# Altium schematic sheet linearInjector_main.SchDoc
size A4
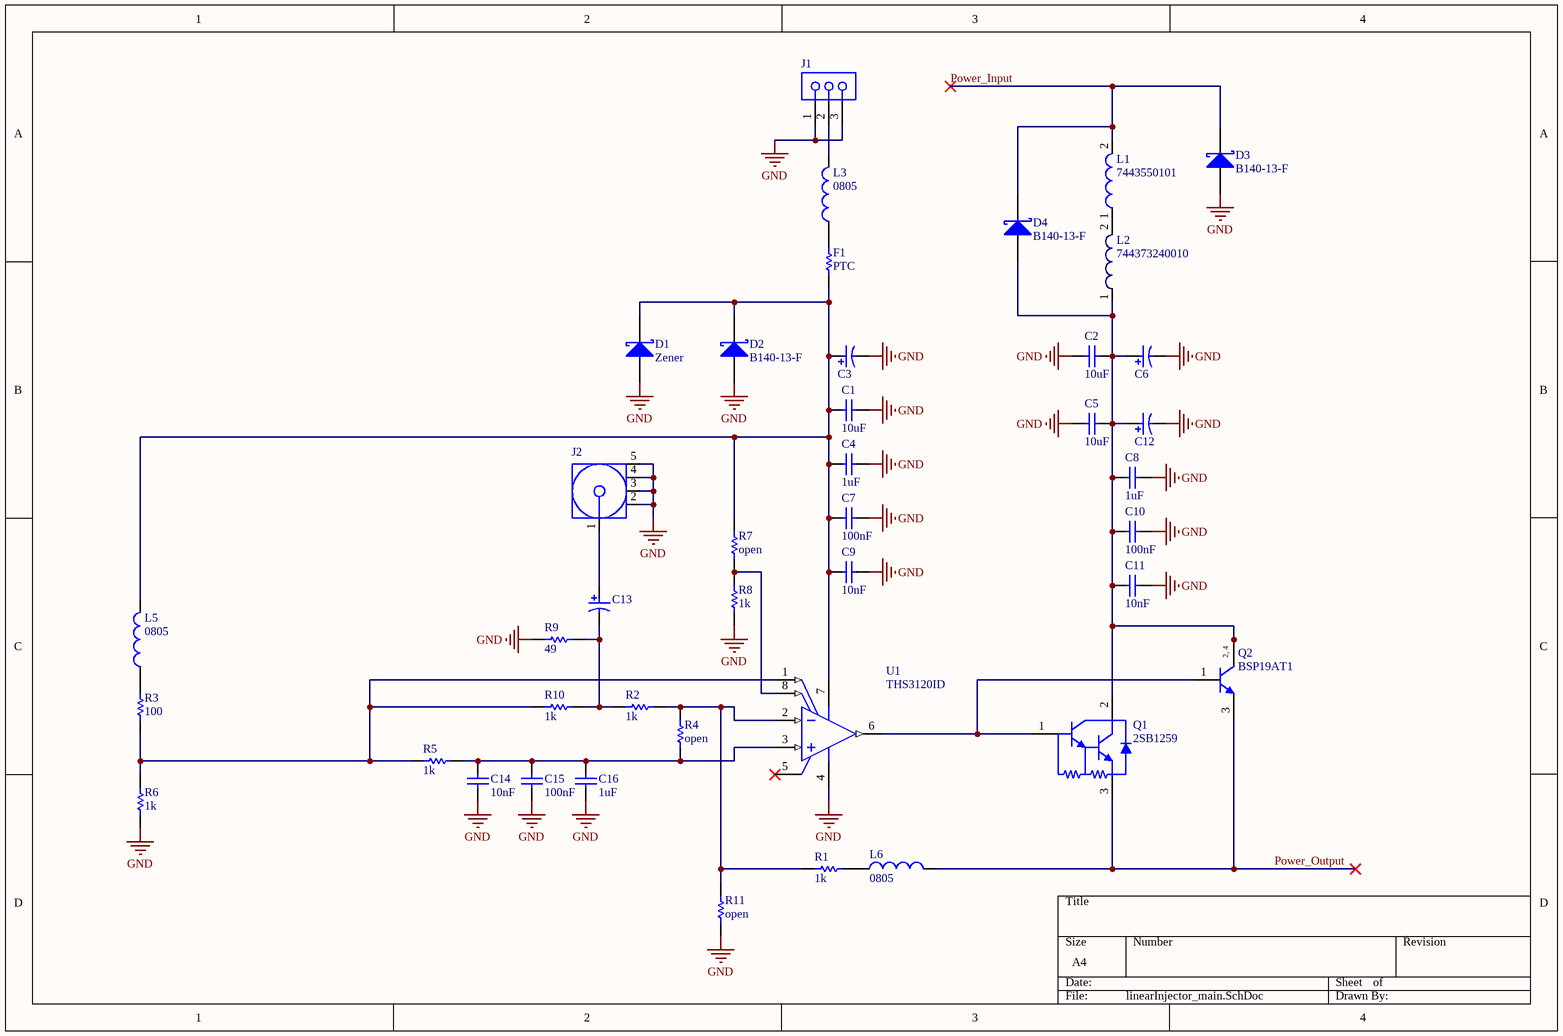
[diagram p0: linearInjector_main.SchDoc]

## Parts
C1  10uF  [CAPC1206(3216)130_M]
C2  10uF  [CAPC1206(3216)130_L]
C3  alum  [PNSC-NF-A_V]  (value not drawn)
C4  1uF  [CAPC0805(2012)75_M]
C5  10uF  [CAPC1206(3216)130_L]
C6  alum  [PNSC-NF-A_V]  (value not drawn)
C7  100nF  [CAPC0805(2012)75_M]
C8  1uF  [CAPC0805(2012)75_M]
C9  10nF  [CAPC0805(2012)75_M]
C10  100nF  [CAPC0805(2012)75_M]
C11  10nF  [CAPC0805(2012)75_M]
C12  alum  [PNSC-NF-A_V]  (value not drawn)
C13  alum  [PNSC-NF-A_V]  (value not drawn)
C14  10nF  [CAPC0805(2012)75_M]
C15  100nF  [CAPC0805(2012)75_M]
C16  1uF  [CAPC0805(2012)75_M]
D1  Zener  [DIOD-B1X0-2_V]
D2  B140-13-F  [DIOD-B1X0-2_V]
D3  B140-13-F  [DIOD-B1X0-2_V]
D4  B140-13-F  [DIOD-B1X0-2_V]
F1  PTC  [RESC1206(3216)_M]
J1  BCS-103-L-S-TE  [SMTC-BCS-103-X-S-TE]  (value not drawn)
J2  LTI-SASF54GT  [LHT-LTI-SASF54GT_V]  (value not drawn)
L1  7443550101  [WE-HCI-1350]
L2  744373240010  [WE-LHMI 4020]
L3  0805  [INDC2013X105X50ML20T30]
L5  0805  [INDC2013X105X50ML20T30]
L6  0805  [INDC2013X105X50ML20T30]
Q1  2SB1259  [ONSC-TO-220-3-221A-09]
Q2  BSP19AT1  [ONSC-SOT-223-4-318E-04_V]
R1  1k  [RESC0805(2012)_M]
R2  1k  [RESC0805(2012)_M]
R3  100  [RESC0805(2012)_M]
R4  open  [RESC0805(2012)_M]
R5  1k  [RESC0805(2012)_M]
R6  1k  [RESC0805(2012)_M]
R7  open  [RESC0805(2012)_M]
R8  1k  [RESC0805(2012)_M]
R9  49  [RESC0805(2012)_M]
R10  1k  [RESC0805(2012)_M]
R11  open  [RESC0805(2012)_M]
U1  THS3120ID  [D0008A_L]

## Nets
GND: C1.2 C2.2 C3.2 C4.1 C5.2 C6.2 C7.1 C8.1 C9.1 C10.1 C11.1 C12.2 C14.1 C15.1 C16.1 D1.2(A) D2.2(A) D3.2(A) J1.1 J1.3 J2.2 J2.3 J2.4 J2.5 R6.1 R8.1 R9.1 R11.1 U1.4(VS-)
Power_Input: D3.1(K) D4.1(K) L1.2
Power_Output: L6.2 Q1.3(E) Q2.3(E)
NetC1_1: C1.1 C3.1 C4.2 C7.2 C9.2 D1.1(K) D2.1(K) F1.1 L5.2 R7.2 U1.7(VS+)
NetC2_1: C2.1 C5.1 C6.1 C8.2 C10.2 C11.2 C12.1 D4.2(A) L2.1 Q1.2(C) Q2.2(C) Q2.4(C)
NetC13_1: C13.1 J2.1
NetC13_2: C13.2 R2.1 R9.2 R10.2
NetC14_2: C14.2 C15.2 C16.2 R4.1 R5.2 U1.3(VIN+)
NetF1_2: F1.2 L3.1
NetJ1_2: J1.2 L3.2
NetL1_1: L1.1 L2.2
NetL5_1: L5.1 R3.2
NetL6_1: L6.1 R1.2
NetQ1_1: Q1.1(B) Q2.1(B) U1.6(VOUT)
NetR1_1: R1.1 R2.2 R4.2 R11.2 U1.2(VIN-)
NetR3_1: R3.1 R5.1 R6.2 R10.1 U1.1(REF)
NetR7_1: R7.1 R8.2 U1.8(PD)

Not connected (* = marked no-connect by the designer): U1 5(NC)*

## Notes on the sheet
- (in symbol CMP-1048-00457-1) 2, 4

## Library data of the parts
C1 C2 C5 = CMP-1037-04970-1: Case-Metric: 3216; Rated Voltage: 10 V; Tolerance: -20% to +80%; Case-EIA: 1206; Value: 10uF; Technology: SMT; Max Thickness: 1.3 mm
C3 C6 C12 C13 = CMP-2000-06196-1: 5mm lead pitch; Manufacturer: Panasonic; Voltage: 5.5Vdc; Lifetime: 1000h; Lead Diameter: 0.8mm; Tolerance Plus: +80%; Tolerance: -20→+80%; Tolerance Minus: -20%; Capacitance: 0.22F; Height: 7.5mm; Manufacturer URL: http://www.panasonic.com/; Depth: 7.5mm; Terminal Type: ThroughHole; Mounting Technology: ThroughHole; Package Reference: NF-A; Maximum Operating Temperature: +70°C; Datasheet URL: https://industrial.panasonic.com/cdbs/www-data/pdf/RDG0000/ABC0000C90.pdf; Dimensions: 13.5(Dia.)x7.5mm; Package Description: 2-Pin Through Hole Device, Dia 13.5 mm; Lead Pitch: 5mm; Datasheet Version: 08/2016; Mounting Type: ThroughHole; Minimum Operating Temperature: -25°C; Diameter: 13.5mm; Series: NF
C4 C7 C8 C10 C15 C16 = CMP-1036-03812-1: Case-EIA: 0805; Value: 10nF; Rated Voltage: 10 V; Tolerance: -20% to +80%; Case-Metric: 2012; Technology: SMT; Max Thickness: 0.75 mm
C9 C11 C14 = CMP-1036-03812-1: Case-EIA: 0805; Rated Voltage: 10 V; Tolerance: -20% to +80%; Case-Metric: 2012; Technology: SMT; Max Thickness: 0.75 mm; Value: 10nF
D1 = CMP-2000-05096-1: option; Manufacturer: DiodesIncorporated; Vrrm - Repetitive Reverse Voltage: 40V; Unit Weight: 0.002258oz; Ir - Reverse Current: 500uA; If - Forward Current: 1A; Ifsm - Forward Surge Current: 30A; Configuration: Single; Vf - Forward Voltage: 0.5V; Type: SchottkyBarrierRectifier; Technology: Si; Mounting Style: SMD/SMT; Package Description: 2-Pin Surface Mount Device, Body 4.3 x 2.605 mm; Datasheet Version: Rev. 18-2, 05/2013; Product: SchottkyDiodes; Height: 2.1mm; RoHS: True; Maximum Operating Temperature: +150C; Manufacturer URL: http://www.diodes.com/; Datasheet URL: http://www.diodes.com/_files/datasheets/ds13002.pdf; Minimum Operating Temperature: -65C; Package / Case: SMA; Termination Style: SMD/SMT; Length: 4.6mm; Operating Temperature Range: -65Cto+150C; Package Reference: SMA; Product Category: SchottkyDiodes&Rectifiers; Factory Pack Quantity: 5000; Series: B140; Width: 2.92mm; Brand: DiodesIncorporated; Packaging: Reel
D2-D4 = CMP-2000-05096-1: Surface Mount Schottky Barrier Rectifier, 1 A, -65 to 150 degC, 2-Pin SMA, RoHS, Tape and Reel; Manufacturer: DiodesIncorporated; Vrrm - Repetitive Reverse Voltage: 40V; Unit Weight: 0.002258oz; Ir - Reverse Current: 500uA; If - Forward Current: 1A; Ifsm - Forward Surge Current: 30A; Configuration: Single; Vf - Forward Voltage: 0.5V; Technology: Si; Mounting Style: SMD/SMT; Package Description: 2-Pin Surface Mount Device, Body 4.3 x 2.605 mm; Datasheet Version: Rev. 18-2, 05/2013; Product: SchottkyDiodes; Height: 2.1mm; RoHS: True; Maximum Operating Temperature: +150C; Manufacturer URL: http://www.diodes.com/; Datasheet URL: http://www.diodes.com/_files/datasheets/ds13002.pdf; Minimum Operating Temperature: -65C; Package / Case: SMA; Termination Style: SMD/SMT; Length: 4.6mm; Operating Temperature Range: -65Cto+150C; Package Reference: SMA; Product Category: SchottkyDiodes&Rectifiers; Factory Pack Quantity: 5000; Series: B140; Width: 2.92mm; Brand: DiodesIncorporated; Type: SchottkyBarrierRectifier; Packaging: Reel
F1 = CMP-1014-00815-1: Fuse; Case-Metric: 3216; Case-EIA: 1206; Tolerance: 1 %; Power: 0.25 W; Value: 499000.00 Ohm; Technology: SMT
J1 = CMP-1023-00005-1: Tiger Claw(TM) Pass-Through Socket, Vertical, -55 to 125 degC, 2.54 mm Pitch, 3-Pin, Female, RoHS; Manufacturer: Samtec; Pitch: 2.54 mm; ComponentLink2URL: http://www.samtec.com/documents/webfiles/pdf/BCS.PDF; ComponentLink2Description: Datasheet; Orientation: Vertical; ComponentLink1Description: Manufacturer URL; ComponentLink3Description: Package Specification; Temperature Range: -55 to 125 degC; PackageVersion: BV, 9/1991; PartNumber: BCS-103-L-S-TE; PackageReference: BCS-103-X-S-TE; DatasheetVersion: F-214; ComponentLink1URL: http://www.samtec.com; PackageDescription: Box Connector Socket Strip; RoHS: True; Mounting Technology: Through-hole; ComponentLink3URL: http://www.samtec.com/documents/webfiles/cpdf/BCS-1XX-XXX-X-XX-XXX-MKT.pdf
J2 = CMP-1713-00001-1: SMA Connector, Pitch 2.54 mm, 1 Position, Height 9.5 mm, Tail Length 4 mm, RoHS; Manufacturer: Lighthorse Technologies Inc.; ComponentLink2Description: Datasheet; Mounting Technology: Through Hole; ComponentLink1Description: Manufacturer URL; PackageDescription: SMA Connector, Pitch 2.54 mm, 1 Position, Height 9.5 mm, Tail Length 4 mm; PartNumber: LTI-SASF54GT; PackageReference: LTI-SASF54GT; DatasheetVersion: Rev. May-99; ComponentLink2URL: http://rfconnector.com/sheets/SASF54GT.pdf; ComponentLink1URL: http://www.rfconnector.com
L1 = CMP-0226-00031-1: SMD Flat Wire High Current Inductor WE-HCI, L=10.0 µH; Inductance: 10.0 ÂµH; DatasheetVersion: ver 1, Aug-2009; ComponentLink2Description: Datasheet; PackageDescription: Inductor, 2-Leads, Body 13.0 x 12.8 mm; ComponentLink2URL: http://www.we-online.de/katalog/media/pdf/7443550101.pdf; PackageReference: WE-HCI-1350; ComponentLink1URL: http://www.we-online.com; PackageVersion: 2008; ComponentLink1Description: Manufacturer Link
L2 = CMP-1353-00038-1: SMD Power Inductor WE-LHMI, L=0.10 µH; Manufacturer: Wuerth Elektronik; Inductance: 0.10 ÂµH; ComponentLink2URL: http://katalog.we-online.de/kataloge/eisos/media/pdf/744373240010.pdf; ComponentLink2Description: Datasheet; PartNumber: 744373240010; ComponentLink1URL: http://www.we-online.com; ComponentLink1Description: Manufacturer URL; PackageReference: WE-LHMI 4020
L3 L5 L6 = CMP-1660-00003-1: Core Material: Ferrite; Current Rating: 6 A; Tolerance: 30%; Resistance: 4 mohm; Impedance: 21 Ohm; Min Operating Temperature: -40 degC; Width: 1.25 mm; PackageDescription: 2-Pin Surface Mount Device, Body 2 x 1.25 mm; Mounting Technology: Surface Mount; Package Quantity: 1; DatasheetVersion: 08/2016; Mount: Surface Mount; Max Operating Temperature: 125 degC; Height: 0.85 mm; ComponentLink1URL: http://www.t-yuden.com/; Case Code (Metric): 2012; ComponentLink1Description: Manufacturer URL; Case\Package: 0805; ComponentLink2URL: http://ds.yuden.co.jp/TYCOMPAS/ut/detail.do?productNo=FBMJ2125HM210NT&fileName=FBMJ2125HM210NT_SS&mode=specSheetDownload; Case Code (Imperial): 0805; Packaging: Tape and Reel; ComponentLink2Description: Datasheet; PackageReference: 0805; RoHSCompliant: true; Max Current Rating: 6 A; Length: 2 mm; REACH SVHC: Unknown
Q1 = CMP-1031-00034-1: PartNumber: MJE5740G; Manufacturer: On Semiconductor; Packing: Tube; Polarity: NPN; IC Continuous (A): 8; PackageReference: TO-220-3-221A-09; ComponentLink2URL: http://www.onsemi.com/pub_link/Collateral/MJE5740-D.PDF; ComponentLink1URL: http://www.onsemi.com/; Mounting Technology: Through Hole; ComponentLink2Description: Datasheet; ComponentLink1Description: Manufacturer URL; ComponentLink3URL: http://www.onsemi.com/pub_link/Collateral/221A-09.PDF; PackageDescription: 3-Pin Flange Mount, Vertical Straight Lead, Body 9.97 x 4.445 mm, Pitch 2.54 mm; PackageVersion: Rev. AG, 09/2011; DatasheetVersion: Rev. 11; RoHS: TRUE; ComponentLink3Description: Package Specification
Q2 = CMP-1048-00457-1: NPN Silicon Expitaxial Transistor, 4-Pin SOT-223, Tape and Reel; Manufacturer: On Semiconductor; fT Min (MHz): 70; IC Continuous (A): 0.1; PackageDescription: 4-Pin Small Outline Transistor, Body 6.5 x 3.5 mm, Pitch 2.3 mm; ComponentLink3URL: http://www.onsemi.com/pub_link/Collateral/318E-04.PDF; PartNumber: BSP19AT1; Mounting Technology: Surface Mount; Polarity: NPN; DatasheetVersion: Rev. 11; ComponentLink1URL: http://www.onsemi.com/; Packing: Tape and Reel; RoHS: FALSE; ComponentLink2URL: http://www.onsemi.com/pub_link/Collateral/BSP19AT1-D.PDF; ComponentLink3Description: Package Specification; ComponentLink2Description: Datasheet; ComponentLink1Description: Manufacturer URL; PackageReference: SOT-223-4-318E-04; PackageVersion: Rev. N, 08/2009
R1-R3 R5-R11 = CMP-1013-00536-1: 1k 1%; Value: 1780.00 Ohm; Case-EIA: 0805; Case-Metric: 2012; Power: 0.125 W; Tolerance: 1 %; Technology: SMT
R4 = CMP-1013-00536-1: Tolerance: 1 %; Value: 1780.00 Ohm; Case-EIA: 0805; Case-Metric: 2012; Power: 0.125 W; Technology: SMT
U1 = CMP-0018-00123-2: Single, Low Noise, High Output Drive, 475 mA Current-Feedback Amplifier with Power-Down, 10 to 30 V, -40 to 85 degC, 8-pin SOIC (D8), Green (RoHS & no Sb/Br); Manufacturer: Texas Instruments; Diff Gain(%): 0.007; Iib(Max)(nA): 20000; BW @ Acl(MHz): 130; Diff Phase(deg): 0.018; Number of Channels: 1; 3rd Harmonic(dBc): 50; Sub Family: High Output Current Amplifier (>=50mA), High Speed Amplifier (>=50MHz), High Supply Voltage Amplifier (>=30V); Vs(Max)(V): 30; Vs(Min)(V): 10; Settling Time (0.1%)(Typ)(ns): 11; Io(Typ)(mA): 475; Vio(Max)(mV): 8; THD (Fc is 1 MHz)(Typ)(dB): -78; Slew Rate(Typ)(V/us): 1700; Vn at Flatband(Typ)(nV/rtHz): 2.5; 2nd Harmonic(dBc): 51; ComponentLink1Description: Manufacturer URL; PackageDescription: 8-Pin Plastic Small Outline, Body 4.9 x 3.9 mm, Pitch 1.27 mm; PartNumber: THS3120ID; Acl, min stable gain(V/V): 1; ComponentLink2Description: Datasheet; PackageVersion: 4040047-3/M, 06/2011; ComponentLink3URL: http://www.ti.com/litv/pdf/msoi002j; ComponentLink3Description: Package Specification; Mounting Technology: Surface Mount; DatasheetVersion: SLOS420E; Code_JEDEC: MS-012; PackageReference: D0008A; @ MHz: 10; ComponentLink2URL: http://www.ti.com/general/docs/lit/getliterature.tsp?genericPartNumber=THS3120&fileType=pdf; Iq per channel(Max)(mA): 11; Eco-Plan: Green (RoHS & no Sb/Br); ComponentLink1URL: http://www.ti.com/